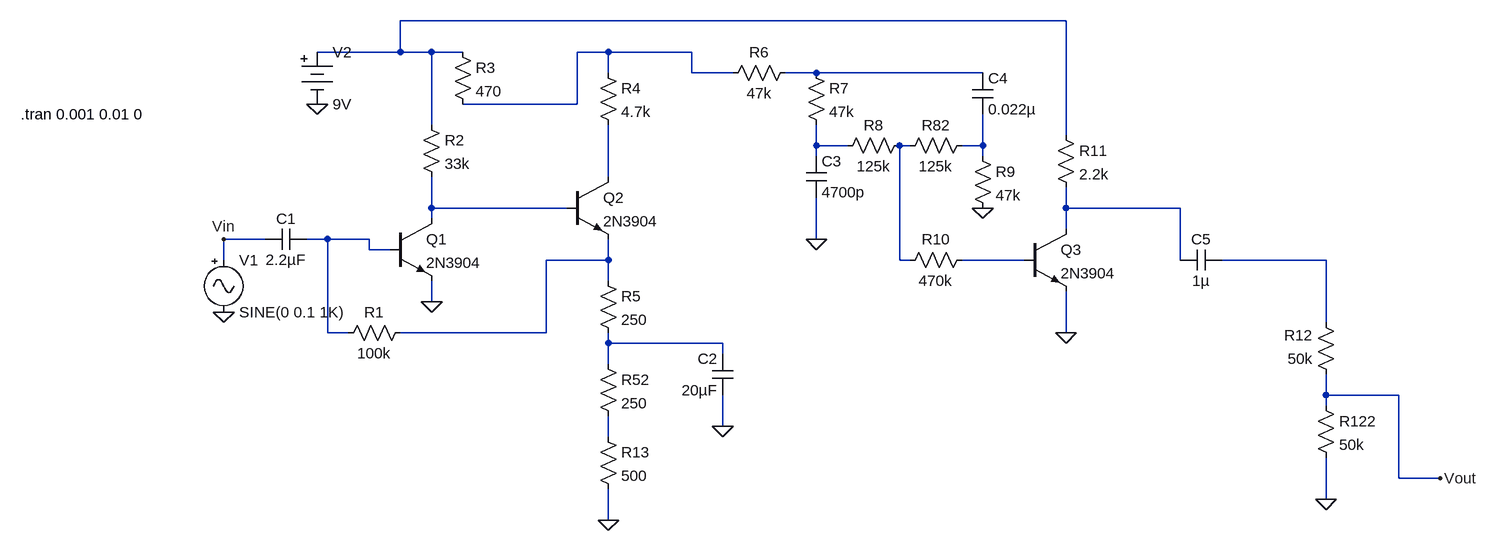
[diagram p0: schematic fuzzfaceJILL.asc]
fuzzfaceJILL.asc, the LTspice schematic file:
Version 4
SHEET 1 2644 848
WIRE 2000 64 976 64
WIRE 976 112 976 64
WIRE 976 112 848 112
WIRE 1024 112 976 112
WIRE 1072 112 1024 112
WIRE 1296 112 1248 112
WIRE 1424 112 1296 112
WIRE 1296 144 1296 112
WIRE 1424 144 1424 112
WIRE 1488 144 1424 144
WIRE 1616 144 1568 144
WIRE 1872 144 1616 144
WIRE 1248 192 1248 112
WIRE 1248 192 1072 192
WIRE 1024 224 1024 112
WIRE 2000 240 2000 64
WIRE 1616 256 1616 224
WIRE 1664 256 1616 256
WIRE 1760 256 1744 256
WIRE 1872 256 1872 208
WIRE 1872 256 1840 256
WIRE 1616 272 1616 256
WIRE 1872 272 1872 256
WIRE 1296 304 1296 224
WIRE 1024 352 1024 304
WIRE 1232 352 1024 352
WIRE 2000 352 2000 320
WIRE 2176 352 2000 352
WIRE 1024 368 1024 352
WIRE 2000 384 2000 352
WIRE 768 400 704 400
WIRE 864 400 832 400
WIRE 928 400 864 400
WIRE 1616 400 1616 336
WIRE 928 416 928 400
WIRE 960 416 928 416
WIRE 704 432 704 400
WIRE 1296 432 1296 400
WIRE 1296 432 1200 432
WIRE 1744 432 1744 256
WIRE 1760 432 1744 432
WIRE 1936 432 1840 432
WIRE 2176 432 2176 352
WIRE 2400 432 2240 432
WIRE 1296 464 1296 432
WIRE 1024 496 1024 464
WIRE 2400 528 2400 432
WIRE 864 544 864 400
WIRE 896 544 864 544
WIRE 1200 544 1200 432
WIRE 1200 544 976 544
WIRE 2000 544 2000 480
WIRE 1296 560 1296 544
WIRE 1472 560 1296 560
WIRE 1472 576 1472 560
WIRE 1296 592 1296 560
WIRE 2400 640 2400 608
WIRE 2512 640 2400 640
WIRE 2400 656 2400 640
WIRE 1472 688 1472 640
WIRE 1296 704 1296 672
WIRE 2512 768 2512 640
WIRE 2576 768 2512 768
WIRE 2400 800 2400 736
WIRE 1296 832 1296 784
FLAG 1024 496 0
FLAG 1472 688 0
FLAG 2400 800 0
FLAG 704 512 0
FLAG 704 400 Vin
FLAG 2576 768 Vout
FLAG 848 192 0
FLAG 1616 400 0
FLAG 1872 352 0
FLAG 2000 544 0
FLAG 1296 832 0
SYMBOL cap 832 384 R90
WINDOW 0 0 32 VBottom 2
WINDOW 3 32 32 VTop 2
SYMATTR InstName C1
SYMATTR Value 2.2µF
SYMBOL res 992 528 R90
WINDOW 0 0 56 VBottom 2
WINDOW 3 32 56 VTop 2
SYMATTR InstName R1
SYMATTR Value 100k
SYMBOL npn 960 368 R0
SYMATTR InstName Q1
SYMATTR Value 2N3904
SYMBOL npn 1232 304 R0
SYMATTR InstName Q2
SYMATTR Value 2N3904
SYMBOL res 1280 448 R0
SYMATTR InstName R5
SYMATTR Value 250
SYMBOL res 1280 128 R0
SYMATTR InstName R4
SYMATTR Value 4.7k
SYMBOL res 1008 208 R0
SYMATTR InstName R2
SYMATTR Value 33k
SYMBOL res 2416 624 R180
WINDOW 0 36 76 Left 2
WINDOW 3 36 40 Left 2
SYMATTR InstName R12
SYMATTR Value 50k
SYMBOL cap 2240 416 R90
WINDOW 0 0 32 VBottom 2
WINDOW 3 32 32 VTop 2
SYMATTR InstName C5
SYMATTR Value 1µ
SYMBOL cap 1488 640 R180
WINDOW 0 24 56 Left 2
WINDOW 3 24 8 Left 2
SYMATTR InstName C2
SYMATTR Value 20µF
SYMBOL res 1280 576 R0
SYMATTR InstName R52
SYMATTR Value 250
SYMBOL res 2384 640 R0
SYMATTR InstName R122
SYMATTR Value 50k
SYMBOL Misc/signal 704 416 R0
SYMATTR InstName V1
SYMATTR Value SINE(0 0.1 1K)
SYMBOL Misc/battery 848 96 R0
SYMATTR InstName V2
SYMATTR Value 9V
SYMBOL res 1056 96 R0
SYMATTR InstName R3
SYMATTR Value 470
SYMBOL res 1584 128 R90
WINDOW 0 0 56 VBottom 2
WINDOW 3 32 56 VTop 2
SYMATTR InstName R6
SYMATTR Value 47k
SYMBOL res 1600 128 R0
SYMATTR InstName R7
SYMATTR Value 47k
SYMBOL res 1856 256 R0
SYMATTR InstName R9
SYMATTR Value 47k
SYMBOL res 1760 240 R90
WINDOW 0 0 56 VBottom 2
WINDOW 3 32 56 VTop 2
SYMATTR InstName R8
SYMATTR Value 125k
SYMBOL res 1856 416 R90
WINDOW 0 0 56 VBottom 2
WINDOW 3 32 56 VTop 2
SYMATTR InstName R10
SYMATTR Value 470k
SYMBOL cap 1856 144 R0
SYMATTR InstName C4
SYMATTR Value 0.022µ
SYMBOL cap 1600 272 R0
SYMATTR InstName C3
SYMATTR Value 4700p
SYMBOL res 1856 240 R90
WINDOW 0 0 56 VBottom 2
WINDOW 3 32 56 VTop 2
SYMATTR InstName R82
SYMATTR Value 125k
SYMBOL npn 1936 384 R0
SYMATTR InstName Q3
SYMATTR Value 2N3904
SYMBOL res 1984 224 R0
SYMATTR InstName R11
SYMATTR Value 2.2k
SYMBOL res 1280 688 R0
SYMATTR InstName R13
SYMATTR Value 500
TEXT 392 208 Left 2 !.tran 0.001 0.01 0

The netlist it stands for:
* fuzzfaceJILL.asc
C1 N010 Vin 2.2µF
R1 N011 N010 100k
Q1 N008 N010 0 0 2N3904
Q2 N007 N008 N011 0 2N3904
R5 N011 N014 250
R4 N002 N007 4.7k
R2 N001 N008 33k
R12 Vout N013 50k
C5 N013 N009 1µ
C2 0 N014 20µF
R52 N014 N015 250
R122 Vout 0 50k
V1 Vin 0 SINE(0 0.1 1K)
V2 N001 0 9V
R3 N001 N002 470
R6 N003 N002 47k
R7 N003 N004 47k
R9 N006 0 47k
R8 N005 N004 125k
R10 N012 N005 470k
C4 N003 N006 0.022µ
C3 N004 0 4700p
R82 N006 N005 125k
Q3 N009 N012 0 0 2N3904
R11 N001 N009 2.2k
R13 N015 0 500
.model NPN NPN
.model PNP PNP
.lib standard.bjt
.tran 0.001 0.01 0
.backanno
.end